# EAGLE design mc-v2-sch (EAGLE 9.2.2)
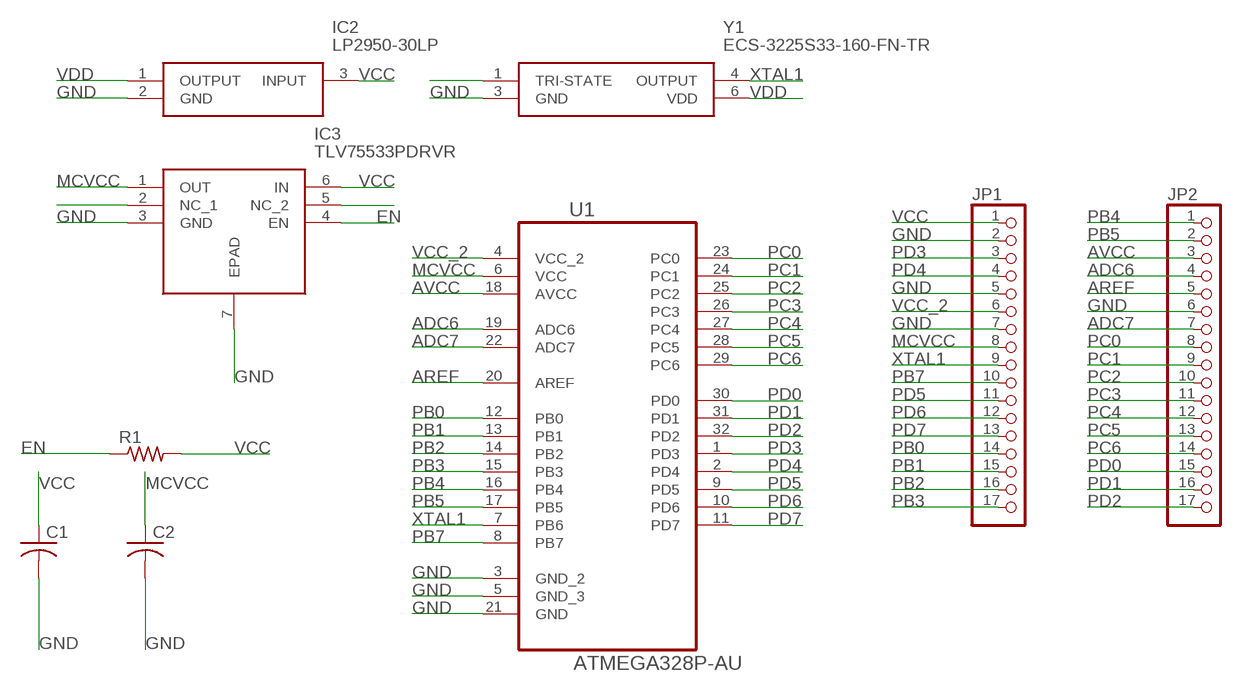
[diagram p0: schematic, sheet 1]

## Parts
C1  C-USC1206  [C1206]
C2  C-USC1206  [C1206]
IC2  LP2950-30LP  [LP0003A]
IC3  TLV75533PDRVR  [SON65P200X200X80-7N]
JP1  PINHD-1X17  [1X17]
JP2  PINHD-1X17  [1X17]
R1  R-US_R0603  [R0603]
U1  ATMEGA328P-AU  [QFP80P900X900X120-32N]
Y1  ECS-3225S33-160-FN-TR  [ECS3225S33200FNTR]

## Nets
ADC6: JP2.4 U1.19(ADC6)
ADC7: JP2.7 U1.22(ADC7)
AREF: JP2.5 U1.20(AREF)
AVCC: JP2.3 U1.18(AVCC)
EN: IC3.4(EN) R1.1
GND: C1.2 C2.2 IC2.2(GND) IC3.3(GND) IC3.7(EPAD) JP1.2 JP1.5 JP1.7 JP2.6 U1.3(GND_2) U1.5(GND_3) U1.21(GND) Y1.3(GND)
MCVCC: C2.1 IC3.1(OUT) JP1.8 U1.6(VCC)
N$1: Y1.1(TRI-STATE)
N$5: IC3.2(NC_1)
N$8: IC3.5(NC_2)
PB0: JP1.14 U1.12(PB0)
PB1: JP1.15 U1.13(PB1)
PB2: JP1.16 U1.14(PB2)
PB3: JP1.17 U1.15(PB3)
PB4: JP2.1 U1.16(PB4)
PB5: JP2.2 U1.17(PB5)
PB7: JP1.10 U1.8(PB7)
PC0: JP2.8 U1.23(PC0)
PC1: JP2.9 U1.24(PC1)
PC2: JP2.10 U1.25(PC2)
PC3: JP2.11 U1.26(PC3)
PC4: JP2.12 U1.27(PC4)
PC5: JP2.13 U1.28(PC5)
PC6: JP2.14 U1.29(PC6)
PD0: JP2.15 U1.30(PD0)
PD1: JP2.16 U1.31(PD1)
PD2: JP2.17 U1.32(PD2)
PD3: JP1.3 U1.1(PD3)
PD4: JP1.4 U1.2(PD4)
PD5: JP1.11 U1.9(PD5)
PD6: JP1.12 U1.10(PD6)
PD7: JP1.13 U1.11(PD7)
VCC: C1.1 IC2.3(INPUT) IC3.6(IN) JP1.1 R1.2
VCC_2: JP1.6 U1.4(VCC_2)
VDD: IC2.1(OUTPUT) Y1.6(VDD)
XTAL1: JP1.9 U1.7(PB6) Y1.4(OUTPUT)

## Library data of the parts
C1 C2 = rcl:C-US: CAPACITOR, American symbol; SPICEPREFIX: C
IC2 = LP2950-30LP:LP2950-30LP: Adjustable Micropower Voltage Regulator With Shutdown Source: Datasheet <http://www.ti.com/lit/gpn/LP2950>; DESCRIPTION: Adjustable Micropower Voltage Regulator With Shutdown; HEIGHT: mm; MANUFACTURER_NAME: Texas Instruments; MANUFACTURER_PART_NUMBER: LP2950-30LP; MOUSER_PART_NUMBER: 595-LP2950-30LP; MOUSER_PRICE-STOCK: https://www.mouser.com/Search/Refine.aspx?Keyword=595-LP2950-30LP; RS_PART_NUMBER: 7620437; RS_PRICE-STOCK: https://uk.rs-online.com/web/p/products/7620437
IC3 = TLV75533PDRVR:TLV75533PDRVR: 500-mA low-IQ small-size low-dropout (LDO) regulator Source: Datasheet <http://www.ti.com/lit/gpn/tlv755p>; DESCRIPTION: 500-mA low-IQ small-size low-dropout (LDO) regulator; HEIGHT: 0.8mm; MANUFACTURER_NAME: Texas Instruments; MANUFACTURER_PART_NUMBER: TLV75533PDRVR; MOUSER_PART_NUMBER: 595-TLV75533PDRVR; MOUSER_PRICE-STOCK: https://www.mouser.com/Search/Refine.aspx?Keyword=595-TLV75533PDRVR
JP1 JP2 = pinhead:PINHD-1X17: PIN HEADER
R1 = rcl:R-US_: RESISTOR, American symbol; SPICEPREFIX: R
U1 = Atmel_By_element14_Batch_1-00:ATMEGA328P-AU: 8-bit Microcontroller with In-System Programmable Flash; MPN: ATMEGA328P-AU; OC_FARNELL: 1715486; OC_NEWARK: 14R4631; PACKAGE: TQFP-32; SUPPLIER: Atmel
Y1 = ECS-3225S33-160-FN-TR:ECS-3225S33-160-FN-TR: Standard Clock Oscillators 16MHz 3.3V 10ppm -40C +85C Source: Datasheet <https://ecsxtal.com/store/pdf/ECS-3225S.pdf>; DESCRIPTION: Standard Clock Oscillators 16MHz 3.3V 10ppm -40C +85C; HEIGHT: 1mm; MANUFACTURER_NAME: ECS; MANUFACTURER_PART_NUMBER: ECS-3225S33-160-FN-TR; MOUSER_PART_NUMBER: 520-3225S33-160-FNT; MOUSER_PRICE-STOCK: https://www.mouser.com/Search/Refine.aspx?Keyword=520-3225S33-160-FNT

## Board
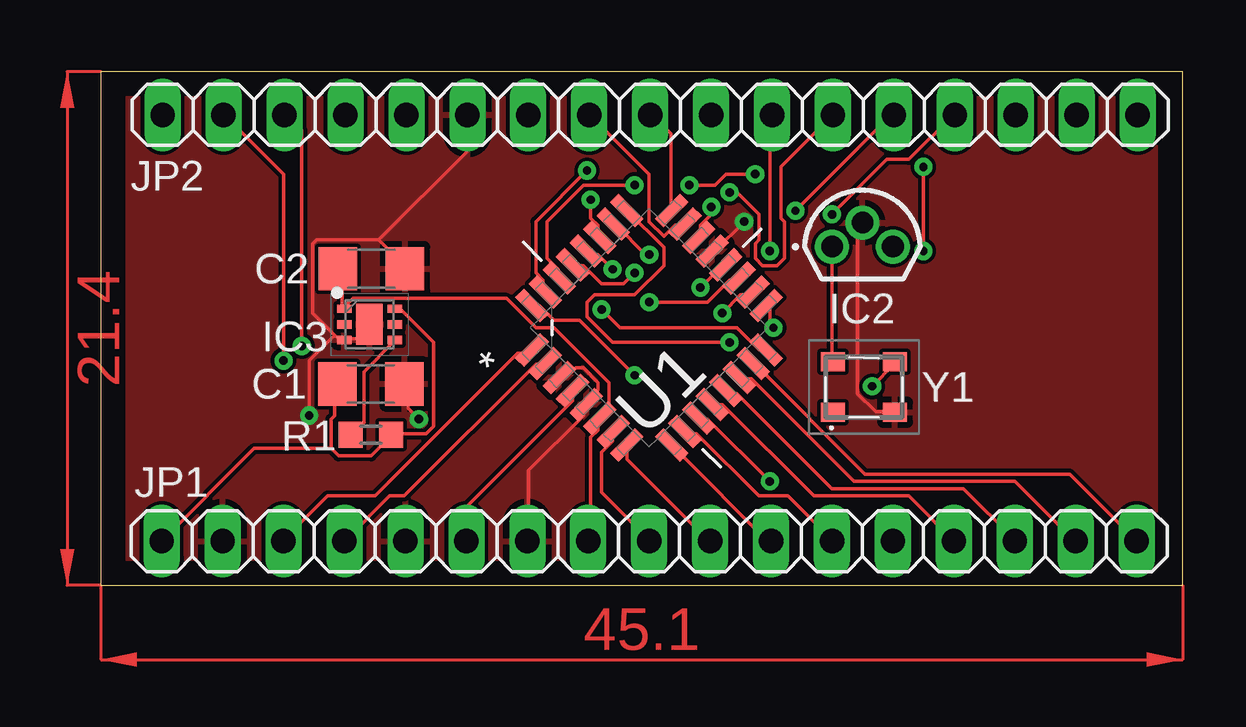
[diagram p1: board, top side]
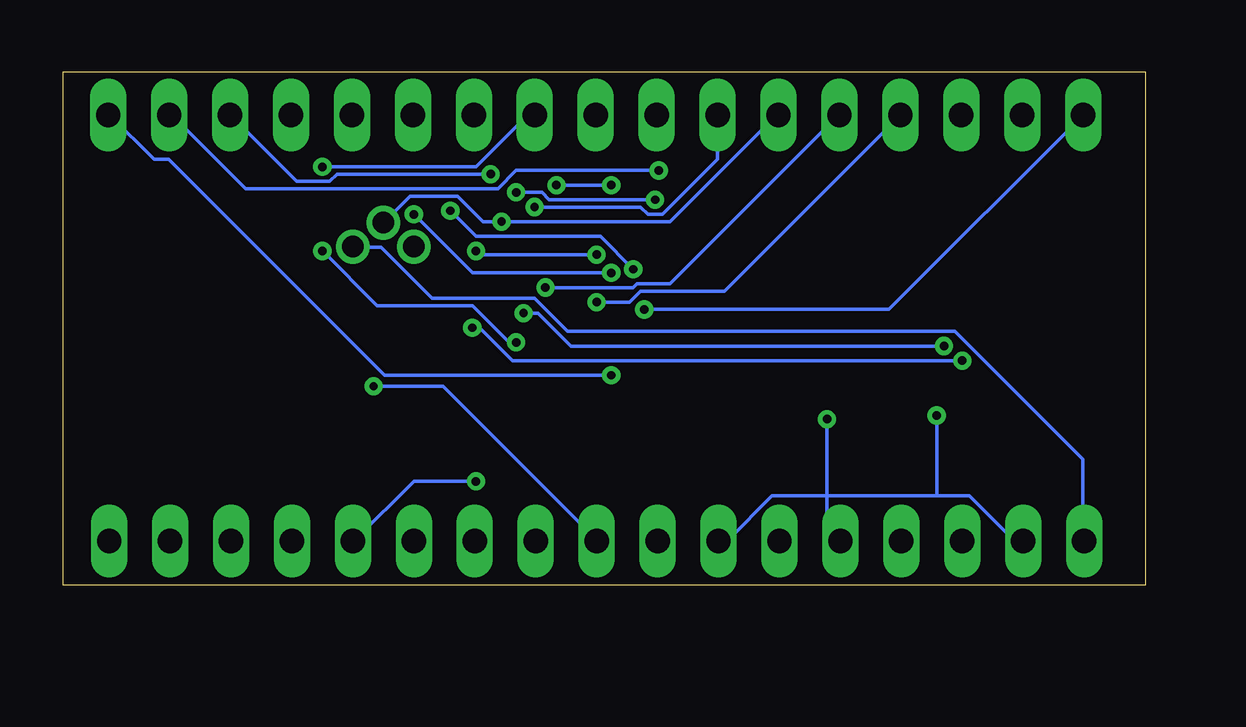
[diagram p2: board, bottom side, seen from below]

Size 45.1 x 21.4 mm. Coordinates in mm from the lower left corner, seen from the top.
Outline: 0,0 45.1,0 45.1,21.4 0,21.4 0,0
Copper layers (1*16): Top 0.035mm / dielectric 1.5mm / Bottom 0.035mm
Design rules "default": minimum track width 6mil, minimum drill 0.35mm, track to track 6mil, track to pad 6mil, pad to pad 6mil, via to via 6mil, smd to smd 6mil, copper to edge 40mil, drill to drill 6mil, minimum pad ring 10mil, minimum via ring 8mil, stop-mask expansion 4mil, vias tented up to drill 0mil, thermal gap 10mil

### Footprints (pad centres in the part's own frame; a part is rotated, then mirrored left to right if it is on the bottom)
C1206 = smd 1.6 x 1.8: 1 -1.4,0; 2 1.4,0
LP0003A = drill 0.9 pad 1.4: 1 -1.27,-1; 2 0,0; 3 1.27,-1
SON65P200X200X80-7N = smd 0.6 x 0.35: 1 -1.05,0.65; 2 -1.05,0; 3 -1.05,-0.65; 4 1.05,-0.65; 5 1.05,0; 6 1.05,0.65 | smd 1.1 x 1.7: 7 0,0
1X17 = drill 1.016 long: 1 -20.32,0; 2 -17.78,0; 3 -15.24,0; 4 -12.7,0; 5 -10.16,0; 6 -7.62,0; 7 -5.08,0; 8 -2.54,0; 9 0,0; 10 2.54,0; 11 5.08,0; 12 7.62,0; 13 10.16,0; 14 12.7,0; 15 15.24,0; 16 17.78,0; 17 20.32,0
R0603 = smd 1 x 1.1: 1 -0.85,0; 2 0.85,0
QFP80P900X900X120-32N = smd 1.473 x 0.508: 1 -4.115,2.794; 2 -4.115,2.007; 3 -4.115,1.194; 4 -4.115,0.406; 5 -4.115,-0.406; 6 -4.115,-1.194; 7 -4.115,-2.007; 8 -4.115,-2.794; 17 4.115,-2.794; 18 4.115,-2.007; 19 4.115,-1.194; 20 4.115,-0.406; 21 4.115,0.406; 22 4.115,1.194; 23 4.115,2.007; 24 4.115,2.794 | smd 0.508 x 1.473: 9 -2.794,-4.115; 10 -2.007,-4.115; 11 -1.194,-4.115; 12 -0.406,-4.115; 13 0.406,-4.115; 14 1.194,-4.115; 15 2.007,-4.115; 16 2.794,-4.115; 25 2.794,4.115; 26 2.007,4.115; 27 1.194,4.115; 28 0.406,4.115; 29 -0.406,4.115; 30 -1.194,4.115; 31 -2.007,4.115; 32 -2.794,4.115
ECS3225S33200FNTR = smd 1 x 0.8: 1 -1.3,-1.05; 3 1.3,-1.05; 4 1.3,1.05; 6 -1.3,1.05

### Placement (x,y rotation side)
C1  11.26,8.39 0 top
C2  11.28,13.19 0 top
IC2  31.75,15.11 0 top
IC3  11.2,10.87 0 top
JP1  22.86,1.84 0 top
JP2  22.9,19.6 0 top
R1  11.26,6.27 0 top
U1  22.86,10.73 45 top
Y1  31.81,8.26 0 top

### Tracks (layer width: path | path; a pad name or v marks a point on that pad's centre or on a via)
ADC6  (via drill 0.35)
  Top 0.152: v22.86,11.8 25.3,11.8 26.21,12.71 26.52,12.71 U1.19
  Bottom 0.152: v22.86,11.8 21.49,11.8 21.03,12.25 17.53,12.25 10.21,19.57 JP2.4
ADC7  (via drill 0.35)
  Top 0.152: v25.45,15.76 25.45,15.45 24.99,15 24.99,14.54 U1.22
  Bottom 0.152: v25.45,15.76 21.03,15.76 20.73,15.45 20.12,15.45 17.83,17.74 17.83,19.57 JP2.7
AREF  (via drill 0.35)
  Top 0.152: v24.99,12.41 25.91,13.32 U1.20
  Bottom 0.152: v24.99,12.41 21.34,12.41 21.18,12.56 19.81,12.56 12.8,19.57 JP2.5
AVCC  (via drill 0.35)
  Top 0.152: v25.91,11.34 26.67,12.1 27.13,12.1 U1.18 | v8.38,9.97 8.38,18.96 7.77,19.57 JP2.3
  Bottom 0.152: v25.91,11.34 25.3,11.34 23.93,9.97 v8.38,9.97
EN
  Top 0.152: IC3.4 12.19,10.12 10.97,8.9 10.97,6.77 10.52,6.31 R1.1
GND  (via drill 0.35)
  Top 0.152: U1.3 19.2,8.75 19.51,8.75 19.81,9.05 20.12,9.05 20.73,8.44 20.73,8.14 20.27,7.68 U1.5 20.12,7.53 20.12,7.07 17.83,4.79 17.83,1.89 JP1.7 | v13.26,6.92 12.8,7.38 12.8,8.29 C1.2 | Y1.3 33.07,7.22 32.31,7.22 31.55,7.99 31.55,14.85 31.7,15 IC2.2 | v26.82,15.15 25.6,13.93 U1.21 | IC3.7 11.12,10.73 10.67,10.27 10.21,10.27 IC3.3 10.06,10.27 9.91,10.27 9.75,10.43 | 9.75,10.43 8.84,11.34 8.84,14.24 8.99,14.39 11.58,14.39 | 11.58,14.39 12.65,13.32 C2.2 | 11.58,14.39 15.24,18.05 15.24,19.57 JP2.6 | v8.69,7.07 8.69,9.36 9.75,10.43
  Bottom 0.152: 13.26,3.72 13.26,2.35 12.8,1.89 JP1.5 | 13.26,3.72 v13.26,6.92 | 13.26,3.72 8.69,3.72 | 8.69,3.72 7.32,3.72 5.49,1.89 5.18,1.89 JP1.2 | 13.26,3.72 15.54,3.72 17.37,1.89 17.68,1.89 JP1.7 | IC2.2 31.7,15.15 30.63,16.22 28.65,16.22 27.58,15.15 v26.82,15.15 19.81,15.15 15.39,19.57 JP2.6 | v8.69,7.07 8.69,3.72
  pour Top: 0,21.4 0,0 45.1,0 45.1,21.3 45.1,21.4
MCVCC
  Top 0.152: C2.1 9.91,13.17 10.06,13.02 10.06,11.64 IC3.1 10.21,11.64 10.52,11.95 16.92,11.95 18.14,10.73 18.9,10.73 21.18,8.44 21.18,7.38 20.88,7.07 U1.6 20.73,6.92 20.73,6.46 20.42,6.16 20.42,1.89 JP1.8
PB0
  Top 0.152: JP1.14 33.68,3.72 29.72,3.72 25.91,7.53 25.6,7.53 U1.12
PB1
  Top 0.152: U1.13 26.06,7.99 26.52,7.99 30.48,4.02 35.97,4.02 38.1,1.89 JP1.15
PB2
  Top 0.152: U1.14 26.67,8.6 27.13,8.6 31.39,4.33 38.1,4.33 40.54,1.89 JP1.16
PB3
  Top 0.152: JP1.17 40.39,4.63 31.85,4.63 27.28,9.21 U1.15
PB4  (via drill 0.35)
  Top 0.152: v20.88,11.49 21.64,10.73 26.52,10.73 27.43,9.82 27.74,9.82 U1.16
  Bottom 0.152: v20.88,11.49 10.67,11.49 2.59,19.57 JP2.1
PB5  (via drill 0.35)
  Top 0.152: v28.04,10.73 27.89,10.88 27.89,11.64 U1.17 | v7.62,9.36 7.62,17.13 5.18,19.57 JP2.2
  Bottom 0.152: v28.04,10.73 27.74,10.73 26.36,9.36 v7.62,9.36
PB7
  Top 0.152: U1.8 21.95,5.7 21.95,5.24 25.3,1.89 JP1.10
PC0
  Top 0.152: U1.23 24.23,15 23.93,15 23.47,14.54 22.86,15.15 22.86,17.13 20.42,19.57 JP2.8
PC1
  Top 0.152: U1.24 23.77,15.76 23.77,18.81 23.01,19.57 JP2.9
PC2  (via drill 0.35)
  Top 0.152: v26.21,10.12 21.34,10.12 20.27,11.19 20.27,11.8 20.57,12.1 22.25,12.1 23.47,13.32 23.47,14.08 21.95,15.61 U1.25 | v34.29,17.44 v34.29,13.93
  Bottom 0.152: v26.21,10.12 26.52,10.12 28.04,11.64 32,11.64 v34.29,13.93 | v34.29,17.44 27.89,17.44 25.76,19.57 25.45,19.57 JP2.10
PC3  (via drill 0.35)
  Top 0.152: v22.86,13.78 22.71,13.78 21.49,15 U1.26 | v27.89,13.93 27.89,19.57 JP2.11
  Bottom 0.152: v22.86,13.78 27.74,13.78 v27.89,13.93
PC4  (via drill 0.35)
  Top 0.152: v20.42,16.06 20.42,15.3 20.73,15 20.73,14.54 U1.27 | v26.21,16.37 26.52,16.37 27.43,15.45 27.43,14.39 27.28,14.24 27.28,13.63 27.58,13.32 28.19,13.32 28.5,13.63 28.5,15.15 28.35,15.3 28.35,17.44 30.48,19.57 JP2.12
  Bottom 0.152: v20.42,16.06 24.84,16.06 25.15,16.37 v26.21,16.37
PC5  (via drill 0.35)
  Top 0.152: v21.34,13.17 20.73,13.78 20.27,13.78 U1.28 | v28.96,15.61 32.92,19.57 JP2.13
  Bottom 0.152: v21.34,13.17 22.71,14.54 27.89,14.54 v28.96,15.61
PC6  (via drill 0.35)
  Top 0.152: v22.25,13.02 21.79,12.56 20.88,12.56 20.12,13.32 19.81,13.32 U1.29 | v30.48,15.45 32.77,17.74 33.68,17.74 35.51,19.57 JP2.14
  Bottom 0.152: v22.25,13.02 28.04,13.02 v30.48,15.45
PD0  (via drill 0.35)
  Top 0.152: v22.25,16.67 20.12,16.67 18.59,15.15 18.59,13.63 19.05,13.17 19.05,12.86 U1.30 | v24.54,16.67 25.6,16.67 26.06,17.13 v27.28,17.13
  Bottom 0.152: v24.54,16.67 v22.25,16.67 | v27.28,17.13 33.68,17.13 33.98,16.83 35.36,16.83 38.1,19.57 JP2.15
PD1  (via drill 0.35)
  Top 0.152: v20.27,17.28 18.14,15.15 18.14,13.02 18.44,12.71 18.44,12.25 U1.31
  Bottom 0.152: v20.27,17.28 26.21,17.28 26.98,16.52 37.49,16.52 40.54,19.57 JP2.16
PD2  (via drill 0.35)
  Top 0.152: v22.25,8.75 19.96,11.04 18.9,11.04 18.29,11.64 17.98,11.64 U1.32
  Bottom 0.152: v22.25,8.75 31.7,8.75 40.69,17.74 41.3,17.74 43.13,19.57 JP2.17
PD3
  Top 0.152: U1.1 17.83,9.66 17.37,9.66 11.43,3.72 9.45,3.72 7.62,1.89 JP1.3
PD4
  Top 0.152: JP1.4 12.04,3.72 12.65,3.72 18.14,9.21 18.44,9.21 U1.2
PD5
  Top 0.152: U1.9 23.93,5.7 27.89,1.74 JP1.11
PD6
  Top 0.152: U1.10 24.38,6.31 24.84,6.31 27.43,3.72 28.65,3.72 30.48,1.89 JP1.12
PD7  (via drill 0.35)
  Top 0.152: v27.89,4.33 25.3,6.92 24.99,6.92 U1.11
  Bottom 0.152: v27.89,4.33 30.48,4.33 32.92,1.89 JP1.13
VCC
  Top 0.152: IC3.6 12.34,11.49 12.5,11.49 13.87,10.12 13.87,6.62 13.56,6.31 12.19,6.31 R1.2 12.04,6.16 11.28,5.4 9.91,5.4 9.6,5.7 | 9.6,5.7 9.6,6.92 9.75,7.07 9.75,8.29 C1.1 | 9.6,5.7 6.4,5.7 JP1.1
  Bottom 0.152: IC2.3 32.92,14.08 31.85,14.08 29.72,11.95 25.45,11.95 24.08,10.58 7.92,10.58 2.59,5.24 2.59,1.89 JP1.1
VCC_2
  Top 0.152: JP1.6 15.24,3.26 19.66,7.68 19.66,7.99 U1.4
VDD
  Top 0.152: IC2.1 30.48,9.36 Y1.6
XTAL1  (via drill 0.35)
  Top 0.152: v32.16,8.29 33.07,9.21 Y1.4 | U1.7 21.34,6.31 21.34,6.01 20.88,5.55 20.88,3.87 22.86,1.89 JP1.9
  Bottom 0.152: v32.16,8.29 29.26,8.29 22.86,1.89 JP1.9
(copper drawn outside any net)
  shapes: Top area x2